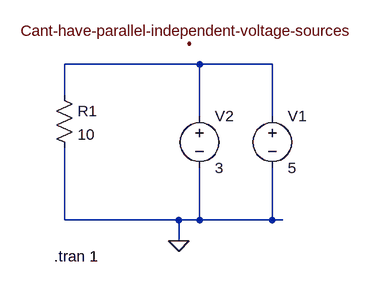
[diagram p0: schematic parallelVoltage.asc]
parallelVoltage.asc, the LTspice schematic file:
Version 4
SHEET 1 880 680
WIRE 192 -128 -16 -128
WIRE 304 -128 192 -128
WIRE -16 -80 -16 -128
WIRE 192 -48 192 -128
WIRE 304 -48 304 -128
WIRE -16 112 -16 0
WIRE 160 112 -16 112
WIRE 192 112 192 32
WIRE 192 112 160 112
WIRE 304 112 304 32
WIRE 304 112 192 112
WIRE 320 112 304 112
WIRE 160 144 160 112
FLAG 160 144 0
FLAG 176 -160 Cant-have-parallel-independent-voltage-sources
SYMBOL voltage 304 -64 R0
WINDOW 123 0 0 Left 2
WINDOW 39 0 0 Left 2
SYMATTR InstName V1
SYMATTR Value 5
SYMBOL voltage 192 -64 R0
SYMATTR InstName V2
SYMATTR Value 3
SYMBOL res -32 -96 R0
SYMATTR InstName R1
SYMATTR Value 10
TEXT -32 168 Left 2 !.tran 1

The netlist it stands for:
* parallelVoltage.asc
V1 N001 0 5
V2 N001 0 3
R1 N001 0 10
.tran 1
.backanno
.end